# EasyEDA Pro project ProDoc_电源控制板.epro

# Schematic Schematic3
Board Name: USB扩展板V2.3; Create Date: 2025-10-12; Page Name: P1; Project Name: FAICAL TRACKER VR模块; Schematic Name: Schematic6_2; Update Date: 2026-01-19; BladeWidth: 10; Company: 嘉立创EDA; Page Size: A4; RegionStart: 1; ShowBorder: 1; TitleBlock: 1; TitleBlockPosition: 3; Version: V1.0; XRegionCount: 6; YRegionCount: 4
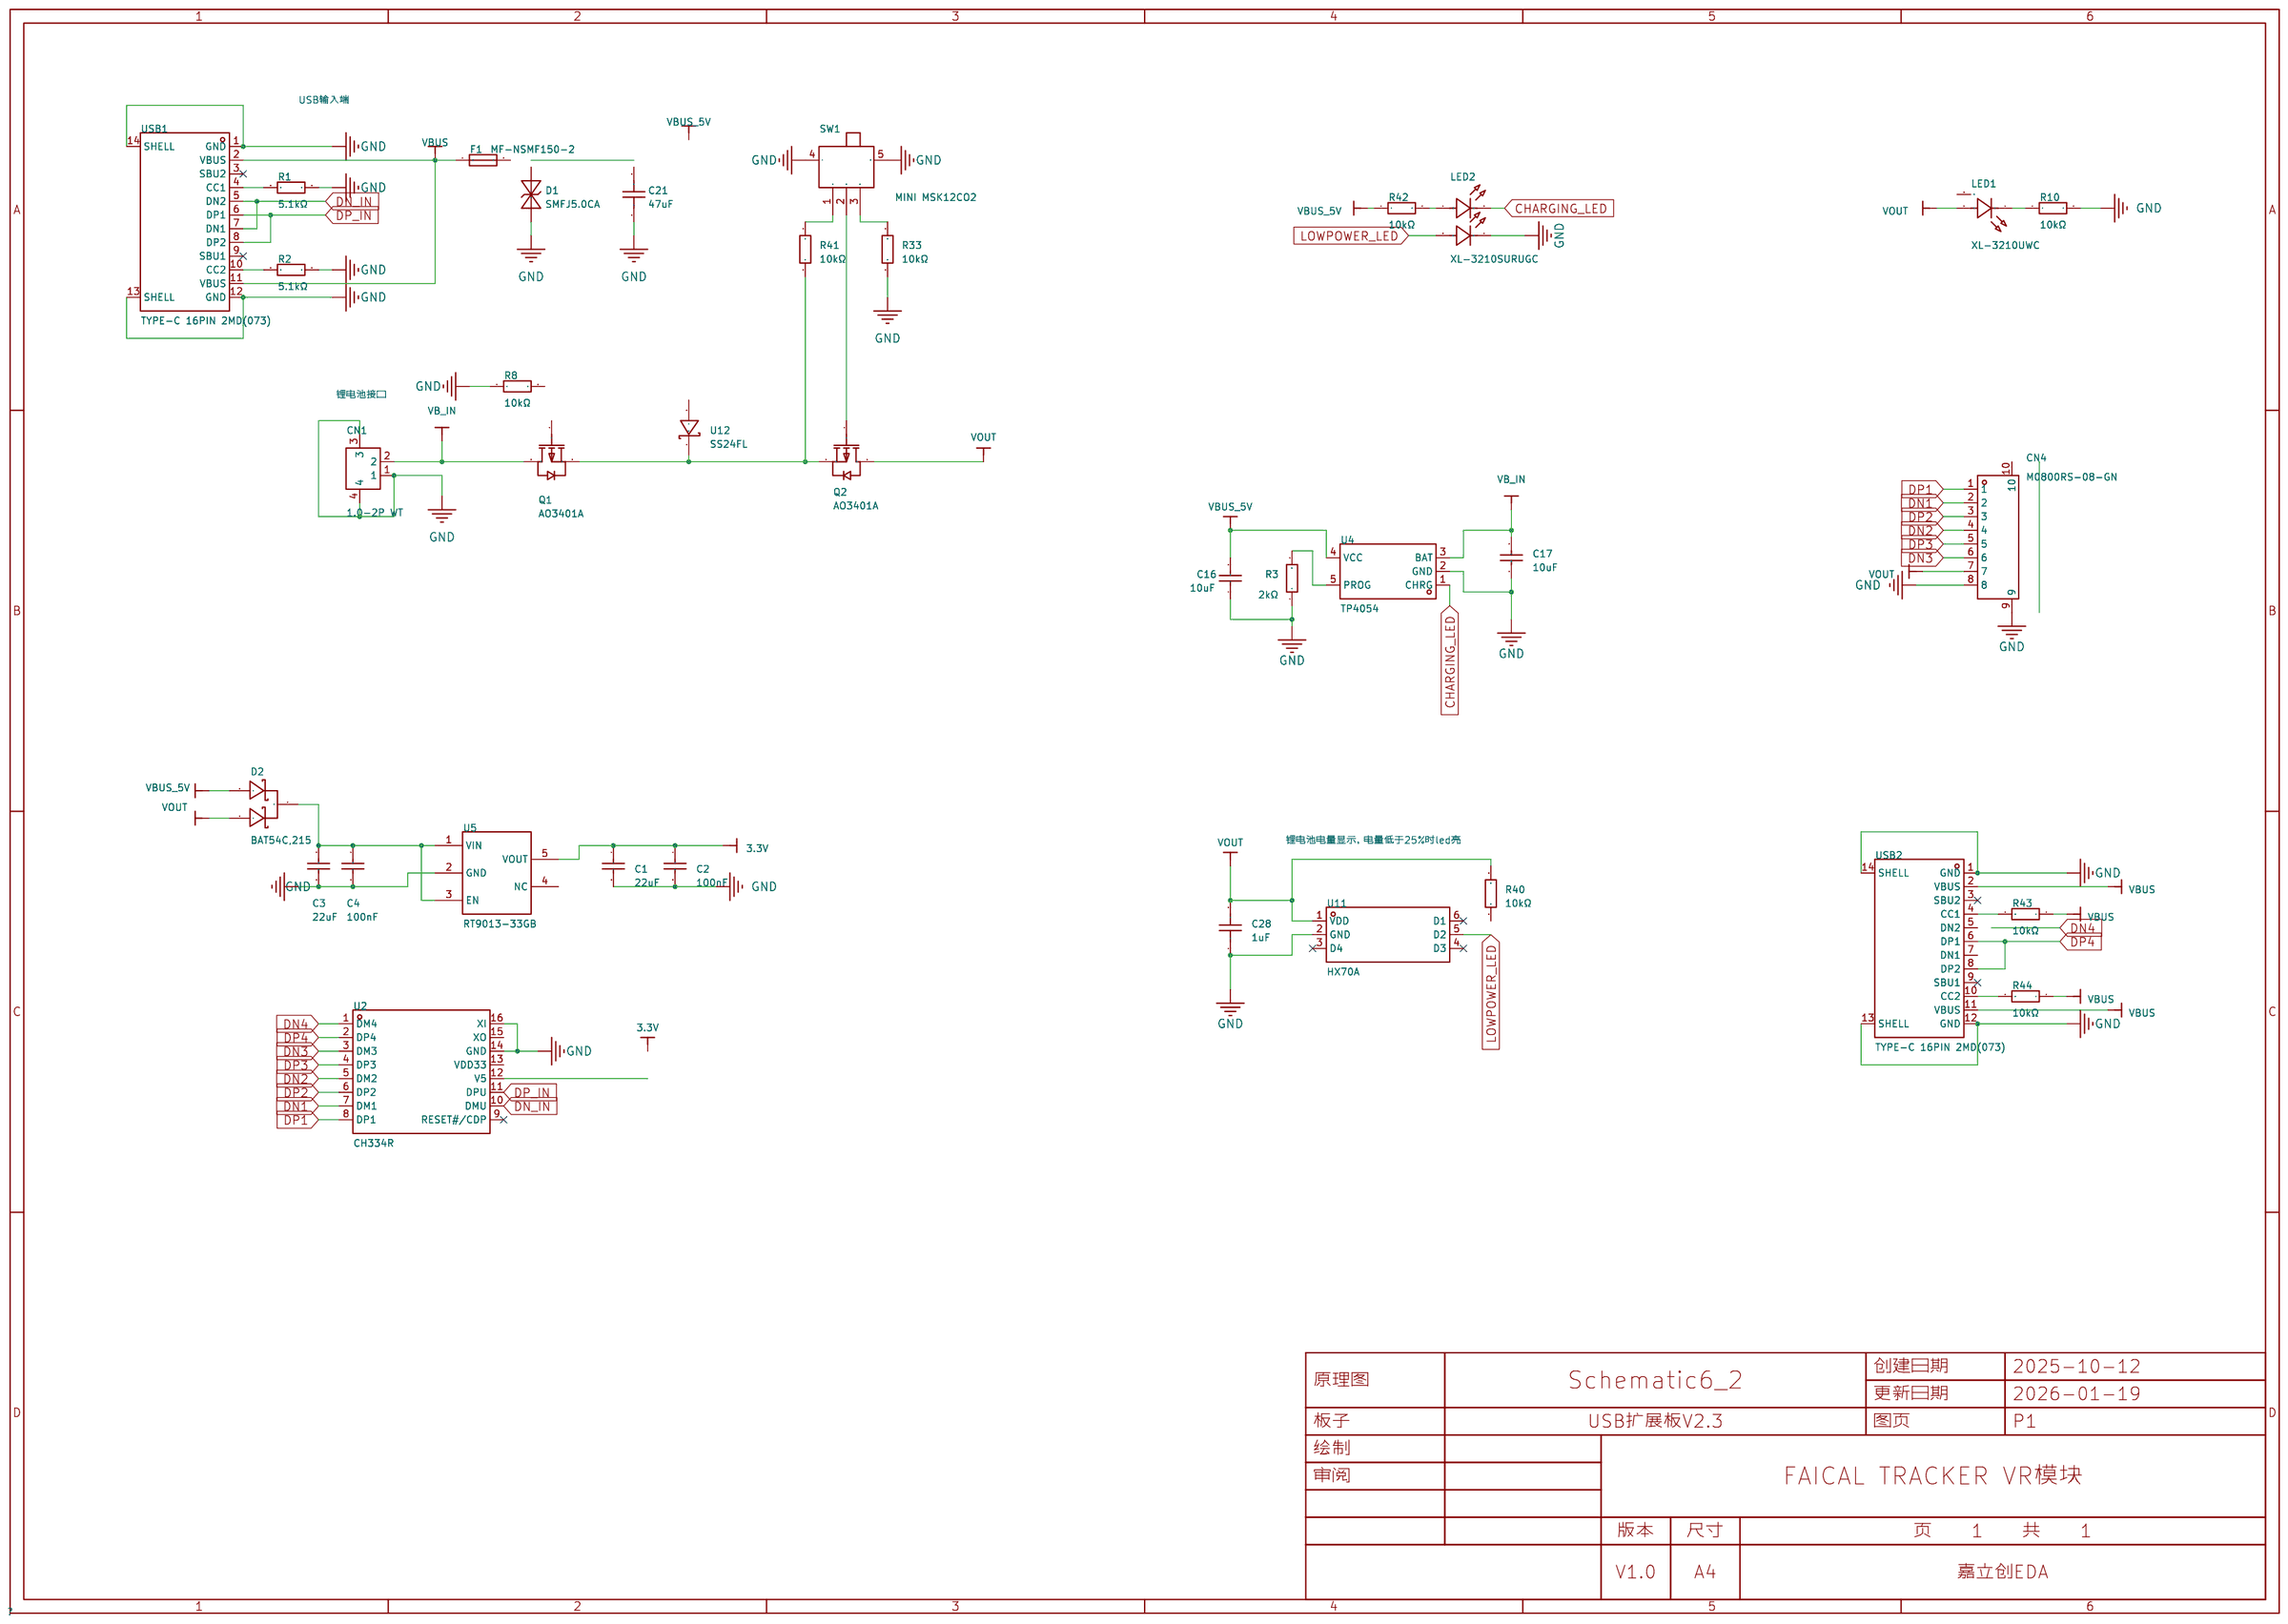
[diagram p0: schematic sheet]

## Parts
C1  22uF  [0603]
C2  100nF  [0402]
C3  22uF  [0603]
C4  100nF  [0402]
C16  10uF  [0603]
C17  10uF  [0603]
C21  47uF  [C1206]
C28  1uF  [0402]
CN1  1.0-2P WT  [CONN-SMD_2P-P1.00_SHOU-HAN_1.0-2P-WT]
CN4  M0800RS-08-GN  [CONN-SMD_M0800RS-08-GN]
D1  SMFJ5.0CA  [SOD-123_L2.7-W1.8-LS3.7-BI]
D2  BAT54C,215  [SOT-23_L2.9-W1.3-P1.90-LS2.4-BR]
F1  MF-NSMF150-2  [F1206]
LED1  XL-3210UWC  [LED-SMD_3P-L3.2-W1.5-RD_ORANGE]
LED2  XL-3210SURUGC  [LED-SMD_4P-L3.2-W1.5_HTG-3210SURUBGC]
Q1  AO3401A  [SOT-23_L2.9-W1.3-P1.90-LS2.4-BR]
Q2  AO3401A  [SOT-23_L2.9-W1.3-P1.90-LS2.4-BR]
R1  5.1kΩ  [0402]
R2  5.1kΩ  [0402]
R3  2kΩ  [0402]
R8  10kΩ  [0402]
R10  10kΩ  [0402]
R33  10kΩ  [0402]
R40  10kΩ  [0402]
R41  10kΩ  [0402]
R42  10kΩ  [0402]
R43  10kΩ  [0402]
R44  10kΩ  [0402]
SW1  MINI MSK12CO2  [SW-SMD_MSK12CO2]
U2  CH334R  [QSOP-16_L4.9-W3.9-P0.64-LS6.0-BL]
U4  TP4054  [SOT-23-5_L3.0-W1.6-P0.95-LS2.8-BL]
U5  RT9013-33GB  [SOT-23-5_L3.0-W1.6-P0.95-LS2.8-BL]
U11  HX70A  [SOT-23-6_L2.9-W1.6-P0.95-LS2.8-BL]
U12  SS24FL  [SOD-123FL_L2.8-W1.8-LS3.6-RD]
USB1  TYPE-C 16PIN 2MD(073)  [USB-C-SMD_TYPE-C-6PIN-2MD-073]
USB2  TYPE-C 16PIN 2MD(073)  [USB-C-SMD_TYPE-C-6PIN-2MD-073]

## Library data of the parts
C1 C3 = CL10A226MQ8NRNC: 容值:22uF;精度:±20%;额定电压:6.3V;温度系数:X5R;; LCSC Part Name: 22uF ±20% 6.3V; Supplier Part: C59461; Manufacturer: SAMSUNG(三星); JLCPCB Part Class: Basic Part; Datasheet: https://item.szlcsc.com/datasheet/CL10A226MQ8NRNC/60514.html; Supplier: LCSC; Tolerance: ±20%; Voltage Rated: 6.3V; Temperature Coefficient: X5R; Voltage Rating: 6.3V
C2 C4 = 0402B104K500NT: 容值:100nF;精度:±10%;额定电压:50V;温度系数:X7R;; LCSC Part Name: 100nF ±10% 50V; Supplier Part: C110251; Manufacturer: FH(风华); JLCPCB Part Class: Extended Part; Datasheet: https://atta.szlcsc.com/upload/public/pdf/source/20200305/C486355_26A10D38EF8C2A5C37091D0039909270.pdf; Supplier: LCSC; Tolerance: ±10%; Voltage Rating: 50V; Temperature Coefficient: X7R
C16 C17 = CL10A106KP8NNNC: 容值:10uF;精度:±10%;额定电压:10V;温度系数:X5R;; LCSC Part Name: 10uF ±10% 10V; Supplier Part: C19702; Manufacturer: SAMSUNG(三星); JLCPCB Part Class: 基础库; Datasheet: https://item.szlcsc.com/datasheet/CL10A106KP8NNNC/20411.html; Supplier: LCSC; Tolerance: ±10%; Voltage Rated: 10V; Temperature Coefficient: X5R; Voltage Rating: 10V
C21 = HGC1206R5476M250NSPJ: 容值:47uF;精度:±20%;额定电压:25V;温度系数:X5R;; LCSC Part Name: 47uF ±20% 25V; Supplier Part: C22367835; Manufacturer: Chinocera(华瓷); Supplier Footprint: 1206; JLCPCB Part Class: 扩展库; Datasheet: https://atta.szlcsc.com/upload/public/pdf/source/20240326/E6CB0DC43BB858B74F4352229FABFDCA.pdf; Supplier: LCSC; Tolerance: ±20%; Voltage Rating: 25V; Temperature Coefficient: X5R
C28 = CL05A105KA5NQNC: 容值:1uF;精度:±10%;额定电压:25V;材质(温度系数):X5R;; LCSC Part Name: 1uF ±10% 25V; Supplier Part: C52923; Manufacturer: SAMSUNG(三星); JLCPCB Part Class: 基础库; Datasheet: https://atta.szlcsc.com/upload/public/pdf/source/20160218/1457707763339.pdf; Supplier: LCSC; Tolerance: ±10%; Voltage Rated: 25V; Temperature Coefficient: X5R
CN1 = 1.0-2P WT: 插针结构:1x2P;间距:1mm;安装方式:卧贴;参考系列:SH;总PIN数:2P;排数:1;每排PIN数:2;行距:-;额定电流:1A;触头材质:磷青铜;触头镀层:锡;工作温度:-25℃~+85℃;; LCSC Part Name: 1.0-2P卧贴 编带; Supplier Part: C2906268; Manufacturer: SHOU HAN(首韩); Supplier Footprint: SMD,P=1mm,卧贴; JLCPCB Part Class: Extended Part; Datasheet: https://item.szlcsc.com/datasheet/1.0-2P%2520WT/3178978.html; Supplier: LCSC; Pins Structure: 1x2P; Pitch: 1mm; Mounting Type: 卧贴; Reference Series: SH; Number of Pins: 2P; Number of Rows: 1; Number of PINs Per Row: 2; Current Rating: 1A; Contact Material: 磷青铜; Contact Plating: 锡; Operating Temperature: -25℃~+85℃; Voltage Rating: 125V; Plastic Material: LCP; Flame Retardant Rating: UL94V-0; Color: 米色
CN4 = M0800RS-08-GN: 插针结构:1x8P;间距:0.8mm;安装方式:卧贴;参考系列:-;总PIN数:8P;排数:1;每排PIN数:8;行距:-;额定电流:-;工作温度范围:-;; LCSC Part Name: 1x8P 间距:0.8mm 卧贴; Supplier Part: C509170; Manufacturer: XFCN(兴飞); Supplier Footprint: SMD,P=0.8mm,卧贴; JLCPCB Part Class: Extended Part; Datasheet: https://atta.szlcsc.com/upload/public/pdf/source/20200407/C509164_BF52F945AC88792F216409D296077FAE.pdf; Supplier: LCSC; Pins Structure: 1x8P; Pitch: 0.8mm; Mounting Style: 卧贴; Number of Pins: 8P; Number of Rows: 1; Number of PINs Per Row: 8
D1 = SMFJ5.0CA: 反向截止电压(Vrwm):5V;最大钳位电压:9.2V;峰值脉冲电流(Ipp):21.7A;击穿电压:6.4V;; Supplier Part: C2905638; Manufacturer: TECH PUBLIC(台舟); Supplier Footprint: SOD-123FL; JLCPCB Part Class: Extended Part; Datasheet: https://atta.szlcsc.com/upload/public/pdf/source/20211026/3B8FA2C5551EFBFD99ABC853C5618374.pdf; Supplier: LCSC; Reverse Stand-Off Voltage (Vrwm): 5V; Maximum Clamping Voltage: 9.2V; Peak Pulse Current (Ipp): 21.7A; Breakdown Voltage: 6.4V; Reverse Leakage Current (Ir): 400uA; Type: TVS
D2 = BAT54C,215: 二极管配置:1对共阴极;正向压降(Vf):800mV@100mA;直流反向耐压(Vr):30V;整流电流:200mA;; LCSC Part Name: 电压:30V 电流:200mA; Supplier Part: C37704; Manufacturer: Nexperia(安世); Supplier Footprint: SOT-23; JLCPCB Part Class: Extended Part; Datasheet: https://item.szlcsc.com/datasheet/BAT54C%252C215/38684.html; Supplier: LCSC; Diode Configuration: 1对共阴极; Voltage - Forward(Vf@If): 800mV@100mA; Voltage - DC Reverse(Vr): 30V; Current - Rectified: 200mA; Reverse Leakage Current (Ir): 2uA@25V; Non-Repetitive Peak Forward Surge Current: 600mA
F1 = MF-NSMF150-2: 最大电压:6V;最大电流:100A;保持电流:1.5A;跳闸电流:3A;; LCSC Part Name: 6V 1.5A 1206自恢复; Supplier Part: C89655; Manufacturer: BOURNS; Supplier Footprint: 1206; JLCPCB Part Class: Extended Part; Datasheet: https://atta.szlcsc.com/upload/public/pdf/source/20161125/1480068355439.pdf; Supplier: LCSC; Operating Voltage (Max): 6V; Current Rating (Max): 100A; Hold Current: 1.5A; Trip Current: 3A; Resistance - Initial (Ri) (Min): 30mΩ; Resistance - Post Trip (R1) (Max): 130mΩ; Maximum Time to Trip: 300ms; Operating Temperature: -40℃~+85℃
LED1 = XL-3210UWC: 灯头类型:-;发光颜色:白色;正向压降(Vf):3.4V;功率:70mW;正向电流:20mA;波长:-;二极管配置:-;透镜颜色:黄色透镜;色温:8000K~12000K;发光强度:1100mcd;发光角度:120°;载带方式:侧贴;工作温度:-40℃~+85℃;; LCSC Part Name: 贴片式发光二极管; Supplier Part: C965880; Manufacturer: XINGLIGHT(成兴光); Supplier Footprint: SMD-3P,3.2x1.5mm; JLCPCB Part Class: 扩展库; Datasheet: https://item.szlcsc.com/datasheet/XL-3210UWC/1051489.html; Supplier: LCSC; Illumination Color: 白色; Voltage - Forward(Vf): 3.4V; Power(Watts): 70mW; Forward Current: 20mA; Lens Color: 黄色透镜; Color Temperature: 8000K~12000K; Luminous Intensity: 1100mcd; Viewing Angle: 120°; Mounting Style: 侧贴; Operating Temperature: -40℃~+85℃
LED2 = XL-3210SURUGC: 灯头类型:-;发光颜色:红色,翠绿色;正向压降(Vf):2.4V；3.4V;功率:50mW；70mW;正向电流:20mA;波长:620nm~630nm；520nm~530nm;二极管配置:-;透镜颜色:无色透明透镜;色温:-;发光强度:180mcd；750mcd;发光角度:120°;载带方式:侧贴;工作温度:-40℃~+85℃;; LCSC Part Name: 红翠绿双色贴片式发光二极管; Supplier Part: C965883; Manufacturer: XINGLIGHT(成兴光); Supplier Footprint: SMD-4P,3.2x1.5mm; JLCPCB Part Class: 扩展库; Datasheet: https://item.szlcsc.com/datasheet/XL-3210SURUGC/1051492.html; Supplier: LCSC; Illumination Color: 红色,翠绿色; Voltage - Forward(Vf): 2.4V；3.4V; Power(Watts): 50mW；70mW; Forward Current: 20mA; Wavelength - Dominant: 620nm~630nm；520nm~530nm; Peak Wavelength: 625nm；525nm; Lens Color: 无色透明透镜; Luminous Intensity: 180mcd；750mcd; Viewing Angle: 120°; Mounting Style: 侧贴; Operating Temperature: -40℃~+85℃
Q1 Q2 = AO3401A_C15127: 数量:1个P沟道;漏源电压(Vdss):30V;连续漏极电流(Id):4A;导通电阻(RDS(on)):47mΩ@10V；85mΩ@2.5V；60mΩ@4.5V;耗散功率(Pd):-;阈值电压(Vgs(th)):900mV@250uA;; LCSC Part Name: 1个P沟道 耐压:30V 电流:4A; Supplier Part: C15127; Manufacturer: AOS; Supplier Footprint: SOT-23; JLCPCB Part Class: Basic Part; Datasheet: https://item.szlcsc.com/datasheet/AO3401A/15801.html; Supplier: LCSC; Number: 1个P沟道; Drain to Source Voltage: 30V; Current - Continuous Drain(Id): 4A; RDS(on): 47mΩ@10V；85mΩ@2.5V；60mΩ@4.5V; Gate Threshold Voltage (Vgs(th)): 900mV@250uA; Gate Charge(Qg): 14nC@10V; Input Capacitance(Ciss): 645pF; Reverse Transfer Capacitance (Crss@Vds): 55pF; Output Capacitance(Coss): 80pF
R1 R2 = 0402WGF5101TCE: 电阻类型:厚膜电阻;阻值:5.1kΩ;精度:±1%;功率:62.5mW;工作电压:50V;温度系数:±100ppm/℃;; LCSC Part Name: 5.1kΩ ±1% 62.5mW 厚膜电阻; Supplier Part: C25905; Manufacturer: UNI-ROYAL(厚声); JLCPCB Part Class: Basic Part; Datasheet: https://item.szlcsc.com/datasheet/0402WGF5101TCE/26648.html; Supplier: LCSC; Type: 厚膜电阻; Tolerance: ±1%; Power(Watts): 62.5mW; Overload Voltage (Max): 50V; Temperature Coefficient: ±100ppm/℃; Operating Temperature Range: -55℃~+155℃; Voltage-Supply(Max): 50V; Operating Temperature: -55℃~+155℃
R3 = 0402WGF2001TCE: 电阻类型:厚膜电阻;阻值:2kΩ;精度:±1%;功率:62.5mW;最大工作电压:50V;温度系数:±100ppm/℃;; LCSC Part Name: 2kΩ ±1% 62.5mW 厚膜电阻; Supplier Part: C4109; Manufacturer: UNI-ROYAL(厚声); JLCPCB Part Class: 基础库; Datasheet: https://atta.szlcsc.com/upload/public/pdf/source/20200306/C422600_1E6D84923E4A46A82E41ADD87F860B5C.pdf; Supplier: LCSC; Type: 厚膜电阻; Tolerance: ±1%; Power(Watts): 62.5mW; Overload Voltage (Max): 50V; Temperature Coefficient: ±100ppm/℃; Operating Temperature Range: -55℃~+155℃
R8 R33 R41 = 0402WGF1002TCE: 电阻类型:厚膜电阻;阻值:10kΩ;精度:±1%;功率:62.5mW;最大工作电压:50V;温度系数:±100ppm/℃;; LCSC Part Name: 10kΩ ±1% 62.5mW 厚膜电阻; Supplier Part: C25744; Manufacturer: UNI-ROYAL(厚声); JLCPCB Part Class: Basic Part; Datasheet: https://atta.szlcsc.com/upload/public/pdf/source/20200306/C422600_1E6D84923E4A46A82E41ADD87F860B5C.pdf; Supplier: LCSC; Type: 厚膜电阻; Tolerance: ±1%; Power(Watts): 62.5mW; Overload Voltage (Max): 50V; Temperature Coefficient: ±100ppm/℃; Operating Temperature Range: -55℃~+155℃
R10 R40 R42-R44 = 0402WGF1002TCE: 电阻类型:厚膜电阻;阻值:10kΩ;精度:±1%;功率:62.5mW;工作电压:50V;温度系数:±100ppm/℃;; LCSC Part Name: 10kΩ ±1% 62.5mW 厚膜电阻; Supplier Part: C25744; Manufacturer: UNI-ROYAL(厚声); JLCPCB Part Class: Basic Part; Datasheet: https://item.szlcsc.com/datasheet/0402WGF1002TCE/26487.html; Supplier: LCSC; Type: 厚膜电阻; Tolerance: ±1%; Power(Watts): 62.5mW; Overload Voltage (Max): 50V; Temperature Coefficient: ±100ppm/℃; Operating Temperature Range: -55℃~+155℃; Voltage-Supply(Max): 50V; Operating Temperature: -55℃~+155℃
SW1 = MINI MSK12CO2: 电路结构:单刀双掷;安装方式:卧贴;开关颜色:白色;额定电流:50mA;额定电压:12V;工作寿命:1万次;; LCSC Part Name: 迷你七脚两档侧拨拨动 mini七7脚 微型拨动; Supplier Part: C2681570; Manufacturer: SHOU HAN(首韩); Supplier Footprint: SMD,5x2.8mm; JLCPCB Part Class: 扩展库; Datasheet: https://item.szlcsc.com/datasheet/MINI%2520MSK12CO2/2774913.html; Supplier: LCSC; Circuit: 单刀双掷; Actuator Style: 矩形柱状; Termination Style: SMD接片; Length: 5mm; Width: 2.75mm; Switch Height: 1.4mm; Mounting Type: 卧贴; Actuator Color: 白色; Current Rating: 50mA; Voltage Rating: 12V; Life: 1万次; Operating Temperature: -25℃~+70℃
U2 = CH334R: CH334和CH335是符合USB2.0协议规范的4端口USBHUB控制器芯片，上行端口支持USB2.0高速和全速，下行端口支持USB2.0高速480Mbps、全速12Mbps和低速1.5Mbps。; Supplier Part: C4154405; Manufacturer: WCH(南京沁恒); Supplier Footprint: QSOP-16-150mil; JLCPCB Part Class: 扩展库; Datasheet: https://atta.szlcsc.com/upload/public/pdf/source/20240313/F70B229B132CE2CA6E618A7ACAF406E8.pdf; Supplier: LCSC; type: 集线器; Protocol: USB 2.0; Data Rate: 480Mbps; Supply Voltage: 5V；3.3V; Operating Temperature: -40℃~+85℃
U4 = TP4054_C668215: 工作电压:4.2V~6.5V;最大充电电流:-;电池类型:锂离子;电池节数:1;; Supplier Part: C668215; Manufacturer: UMW(友台半导体); Supplier Footprint: SOT-23-5L; JLCPCB Part Class: 扩展库; Datasheet: https://item.szlcsc.com/datasheet/TP4054/698063.html; Supplier: LCSC; The Chip Type: 充电芯片; Voltage - Supply: 4.2V~6.5V; Charging Saturation Voltage: 4.2V; Type of Battery: 锂离子; Number of Cells: 1; Operating Temperature: -40℃~+85℃; Supply Current (Iq): 25uA
U5 = RT9013-33GB: 输出类型:固定;工作电压:5.5V;输出电压:3.3V;输出电流:500mA;电源纹波抑制比(PSRR):50dB@(10kHz);输出极性:正极;; LCSC Part Name: 输入5.5V 输出3.3V 500mA; Supplier Part: C47773; Manufacturer: RICHTEK(立锜); Supplier Footprint: SOT-23-5; JLCPCB Part Class: 扩展库; Datasheet: https://item.szlcsc.com/datasheet/RT9013-33GB/48778.html; Supplier: LCSC; Output Type: 固定; Voltage - Supply: 5.5V; Output Voltage: 3.3V; Output Current: 500mA; Power Supply Rejection Ratio (PSRR): 50dB@(10kHz); Voltage Dropout: 400mV@(500mA); standby current: 25uA; Noise: 30uVrms; Features: 带使能；过热保护；过流保护; Operating Temperature: -40℃~+125℃@(Tj); Output Configuration: 正极; Number of Outputs: 1
U11 = HX70A: Supplier Part: C2846626; Supplier Footprint: SOT-23-6; JLCPCB Part Class: Extended Part; Supplier: LCSC
U12 = SS24FL_C894433: 正向压降(Vf):550mV@2A;直流反向耐压(Vr):40V;整流电流:2A;; LCSC Part Name: 电压:40V 电流:2A; Supplier Part: C894433; Manufacturer: onsemi(安森美); Supplier Footprint: SOD-123F; JLCPCB Part Class: 扩展库; Datasheet: https://item.szlcsc.com/datasheet/SS24FL/959862.html; Supplier: LCSC; Voltage - Forward(Vf@If): 550mV@2A; Voltage - DC Reverse(Vr): 40V; Current - Rectified: 2A; Reverse Leakage Current (Ir): 100uA@40V; Operating Junction Temperature Range: -55℃~+125℃; Non-Repetitive Peak Forward Surge Current: 50A
USB1 USB2 = TYPE-C 16PIN 2MD(073): 连接器类型:Type-C;协议标准:USB 3.1;公母:母;安装方式:卧贴;触点数量:16P;端口数量:1;额定电流 - 电源:3A;工作温度:-25℃~+85℃;; LCSC Part Name: Type-C 母 卧贴; Supplier Part: C2765186; Manufacturer: SHOU HAN(首韩); Supplier Footprint: SMD; JLCPCB Part Class: 扩展库; Datasheet: https://item.szlcsc.com/datasheet/TYPE-C%252016PIN%25202MD(073)/2901843.html; Supplier: LCSC; Connector Type: Type-C; Protocol Standard: USB 3.1; Gender: 母; Mounting Type: 卧贴; Number of Contacts: 16P; Number of Ports: 1; Current Rating-Power: 3A; Voltage Rating: 5V; Connect-Disconnect Life: 5千次; Detection color: 黑色; Operating Temperature: -25℃~+85℃

## Nets
3.3V: C1.1 C2.1 U2.12(V5) U2.13(VDD33) U5.5(VOUT)
GND: C1.2 C2.2 C3.1 C4.1 C16.1 C17.1 C21.1 C28.1 CN1.1 CN1.3 CN1.4 CN4.8 CN4.9 CN4.10 D1.1 LED2.4(R-) R1.1 R2.1 R3.1 R8.1 R10.2 R33.1 SW1.4 SW1.5 U2.14(GND) U2.16(XI) U4.2(GND) U5.2(GND) U11.2(GND) USB1.1(GND) USB1.12(GND) USB1.13(SHELL) USB1.14(SHELL) USB2.1(GND) USB2.12(GND) USB2.13(SHELL) USB2.14(SHELL)
VBUS: F1.1 R43.1 R44.1 USB1.2(VBUS) USB1.11(VBUS) USB2.2(VBUS) USB2.11(VBUS)
VBUS_5V: C16.2 C21.2 D1.2 D2.1(A) F1.2 Q1.1(G) R8.2 R42.1 U4.4(VCC) U12.2(A)
CHARGING_LED: LED2.2(G-) U4.1(CHRG)
DN1: CN4.2 U2.7(DM1)
DN2: CN4.4 U2.5(DM2)
DN3: CN4.6 U2.3(DM3)
DN4: U2.1(DM4) USB2.5(DN2) USB2.7(DN1)
DN_IN: U2.10(DMU) USB1.5(DN2) USB1.7(DN1)
DP1: CN4.1 U2.8(DP1)
DP2: CN4.3 U2.6(DP2)
DP3: CN4.5 U2.4(DP3)
DP4: U2.2(DP4) USB2.6(DP1) USB2.8(DP2)
DP_IN: U2.11(DPU) USB1.6(DP1) USB1.8(DP2)
LOWPOWER_LED: LED2.3(R+) R40.1 U11.5(D2)
VB_IN: C17.2 CN1.2 Q1.3(D) U4.3(BAT)
VOUT: C28.2 CN4.7 D2.2(A) LED1.2(A) Q2.3(D) R40.2 U11.1(VDD)
$1N510: R2.2 USB1.10(CC2)
$1N514: R1.2 USB1.4(CC1)
$1N3050: LED1.1(K) R10.1
$1N38183: R33.2 SW1.3
$1N38879: R3.2 U4.5(PROG)
$1N38917: Q2.1(G) SW1.2
$1N38949: Q1.2(S) Q2.2(S) R41.2 U12.1(C)
$1N38952: R41.1 SW1.1
$1N41051: R44.2 USB2.10(CC2)
$1N41052: R43.2 USB2.4(CC1)
$1N42853: LED2.1(G+) R42.2
$1N44886: C3.2 C4.2 D2.3(K) U5.1(VIN) U5.3(EN)

Not connected (* = marked no-connect by the designer): LED1 3; U2 9(RESET#/CDP)* 15(XO); U5 4(NC); U11 3(D4)* 4(D3)* 6(D1)*; USB1 3(SBU2)* 9(SBU1)*; USB2 3(SBU2)* 9(SBU1)*

## Notes on the sheet
- USB输入端
- 锂电池接口
- 锂电池电量显示，电量低于25%时led亮

# Board PCB3
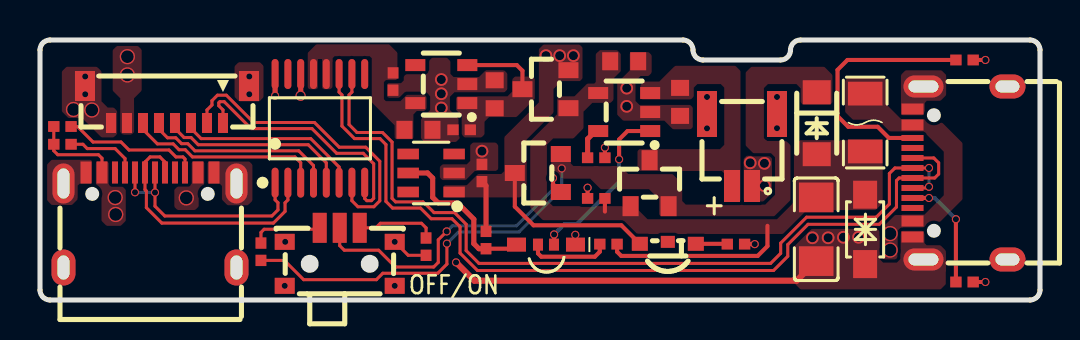
[diagram p1: board, top side]
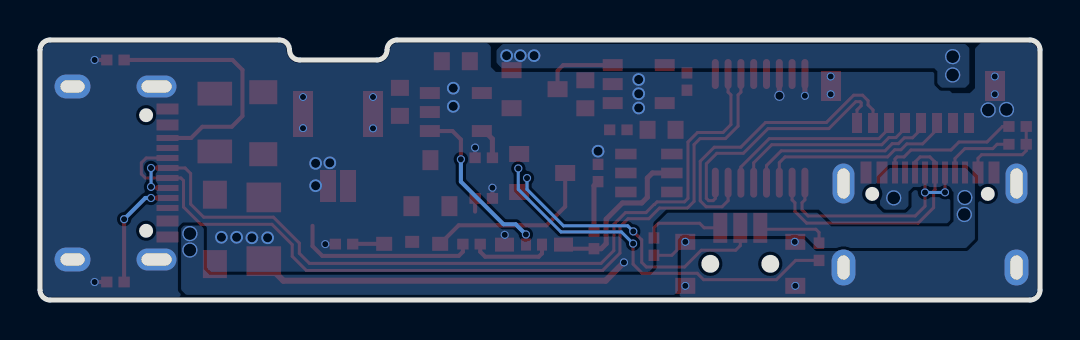
[diagram p2: board, bottom side, seen from below]

Outline 50 x 13 mm; copper layers: Top Layer, Bottom Layer. Coordinates in mm from the lower left corner of the outline.
Outline path: 0,12.5 arc(0.15,12.85) 0.5,13 32.15,13 arc(32.5,12.85) 32.65,12.5 arc(32.8,12.15) 33.15,12 37.03,12 arc(37.38,12.15) 37.53,12.5 arc(37.67,12.85) 38.03,13 49.5,13 arc(49.85,12.85) 50,12.5 50,0.5 arc(49.85,0.15) 49.5,0 0.5,0 arc(0.15,0.15) 0,0.5 0,12.5
Stack: Top Layer 0.035mm / SUBSTRATE1 0.91mm FR4 er 4.5 / Bottom Layer 0.035mm

## Design rules (mm)
net DP2: DP3
net DP3: DP2
net DP4: DP1
net DP1: DP5
net DP_IN: DP4
net DN4: DP1
net DN3: DP2
net DN2: DP3
net DN1: DP5
net DN_IN: DP4
spacing copperThickness1oz (default): track to track 0.152, other pairs 0 to 0.3
spacing copperThickness2oz: track to track 0.203, other pairs 0.152 to 0.3
spacing Copper_copperRegion: track to track 0.152, other pairs 0 to 0.3
spacing Copper_copperRegion1: track to track 0.152, other pairs 0 to 0.3
spacing Plane_innerPlane: track to track 0.152, other pairs 0 to 0.3
track width copperThickness1oz (default): min 0.127, default 0.254, max 2.54
track width copperThickness2oz: min 0.203, default 0.254, max 2.54
differential pair USB-90Ω (default): width min 0.152, default 0.152, max 0.203; gap min 0.152, default 0.152
differential pair differentialPair: width min 0.127, default 0.254, max 2.54; gap min 0.152, default 0.152
pour e52 uses Copper_copperRegion, copperRegion1_Copper_copperRegion
net GND uses copperRegion_copperThickness1oz
pour e136 uses Copper_copperRegion, copperRegion1_Copper_copperRegion
pour e156 uses Copper_copperRegion, copperRegion1_Copper_copperRegion
pour e197 uses Copper_copperRegion, copperRegion1_Copper_copperRegion
pour e212 uses Copper_copperRegion, copperRegion1_Copper_copperRegion
pour e334 uses Copper_copperRegion, copperRegion1_Copper_copperRegion
net VBUS_5V uses copperRegion1_copperThickness1oz
net VB_IN uses copperRegion1_copperThickness1oz
net $1N38949 uses copperRegion1_copperThickness1oz
net 3.3V uses copperRegion1_copperThickness1oz
net VOUT uses copperRegion1_copperThickness1oz
net $1N44886 uses copperRegion1_copperThickness1oz
pour e19 uses Copper_copperRegion1, copperRegion_Copper_copperRegion1
pour e407 uses Copper_copperRegion1, copperRegion1_Copper_copperRegion1
pour e409 uses Copper_copperRegion1, copperRegion1_Copper_copperRegion1
pour e481 uses Copper_copperRegion, copperRegion1_Copper_copperRegion
pour e483 uses Copper_copperRegion, copperRegion1_Copper_copperRegion
pour e485 uses Copper_copperRegion, copperRegion1_Copper_copperRegion
pour e487 uses Copper_copperRegion, copperRegion1_Copper_copperRegion

## Placement (name value [footprint] x y rotation side)
C1  22uF  [0603]  18.92 8.51 0 top
C2  100nF  [0402]  17.65 10.92 270 top
C3  22uF  [0603]  22.73 10.29 270 top
C4  100nF  [0402]  21.08 8.51 0 top
C16  10uF  [0603]  29.21 11.94 180 top
C17  10uF  [0603]  32 9.91 90 top
C21  47uF  [C1206]  38.81 3.54 90 top
C28  1uF  [0402]  22.1 6.35 270 top
CN1  1.0-2P WT  [CONN-SMD_2P-P1.00_SHOU-HAN_1.0-2P-WT]  35.1 7.5 180 top
CN4  M0800RS-08-GN  [CONN-SMD_M0800RS-08-GN]  6.35 9.8 180 top
D1  SMFJ5.0CA  [SOD-123_L2.7-W1.8-LS3.7-BI]  41.26 3.53 90 top
D2  BAT54C,215  [SOT-23_L2.9-W1.3-P1.90-LS2.4-BR]  25.27 10.54 0 top
F1  MF-NSMF150-2  [F1206]  41.26 8.87 270 top
LED1  XL-3210UWC  [LED-SMD_3P-L3.2-W1.5-RD_ORANGE]  31.39 2.94 180 top
LED2  XL-3210SURUGC  [LED-SMD_4P-L3.2-W1.5_HTG-3210SURUBGC]  25.3 2.64 180 top
Q1  AO3401A  [SOT-23_L2.9-W1.3-P1.90-LS2.4-BR]  30.48 5.84 270 top
Q2  AO3401A  [SOT-23_L2.9-W1.3-P1.90-LS2.4-BR]  24.89 6.35 0 top
R1  5.1kΩ  [0402]  46.23 0.9 180 top
R2  5.1kΩ  [0402]  46.23 12 180 top
R3  2kΩ  [0402]  27.81 7.11 180 top
R8  10kΩ  [0402]  27.81 5.08 0 top
R10  10kΩ  [0402]  34.8 2.79 0 top
R33  10kΩ  [0402]  19.3 2.67 90 top
R40  10kΩ  [0402]  22.3 3 90 top
R41  10kΩ  [0402]  11.05 2.41 270 top
R42  10kΩ  [0402]  28.42 2.79 180 top
R43  10kΩ  [0402]  1.12 7.79 0 top
R44  10kΩ  [0402]  1.12 8.68 0 top
SW1  MINI MSK12CO2  [SW-SMD_MSK12CO2]  14.99 2.16 0 top
U2  CH334R  [QSOP-16_L4.9-W3.9-P0.64-LS6.0-BL]  14 8.58 0 top
U4  TP4054  [SOT-23-5_L3.0-W1.6-P0.95-LS2.8-BL]  29.21 9.4 90 top
U5  RT9013-33GB  [SOT-23-5_L3.0-W1.6-P0.95-LS2.8-BL]  20.07 10.8 90 top
U11  HX70A  [SOT-23-6_L2.9-W1.6-P0.95-LS2.8-BL]  19.56 6.35 90 top
U12  SS24FL  [SOD-123FL_L2.8-W1.8-LS3.6-RD]  38.84 8.84 270 top
USB1  TYPE-C 16PIN 2MD(073)  [USB-C-SMD_TYPE-C-6PIN-2MD-073]  46 6.35 90 top
USB2  TYPE-C 16PIN 2MD(073)  [USB-C-SMD_TYPE-C-6PIN-2MD-073]  5.5 4 0 top

## Footprints (pads in the part's own frame, mm; a bottom-side part is the same pattern mirrored in y, then rotated)
0402
  rect 0.566x0.54 smd: 1(-0.433,0) 2(0.433,0)
0603
  rect 0.8x0.9 smd: 1(-0.7,0) 2(0.7,0)
C1206
  rect 1.485x1.728 smd: 1(-1.593,0) 2(1.593,0)
CONN-SMD_2P-P1.00_SHOU-HAN_1.0-2P-WT
  rect 0.8x1.6 smd: 1(-0.5,1.8) 2(0.5,1.8)
  rect 1x2.3 smd: 3(1.75,-1.8) 4(-1.75,-1.8)
CONN-SMD_M0800RS-08-GN
  rect 0.5x1 smd: 1(-2.8,0.95) 2(-2,0.95) 3(-1.2,0.95) 4(-0.4,0.95) 5(0.4,0.95) 6(1.2,0.95) 7(2,0.95) 8(2.8,0.95)
  rect 1x1.5 smd: 9(4.1,-0.9) 10(-4.1,-0.9)
F1206
  rect 1.19x1.728 smd: 1(-1.445,0) 2(1.445,0)
LED-SMD_3P-L3.2-W1.5-RD_ORANGE
  rect 0.8x0.7 smd: 1(-1.4,0.127) 2(1.4,0.127)
  rect 0.7x0.6 smd: 3(0,0.03)
LED-SMD_4P-L3.2-W1.5_HTG-3210SURUBGC
  rect 0.5x0.6 smd: 1(0.4,-0.133) 2(-0.4,-0.133)
  rect 0.95x0.7 smd: 3(1.475,-0.132) 4(-1.475,-0.132)
QSOP-16_L4.9-W3.9-P0.64-LS6.0-BL
  oval 0.35x1.5 smd: 1(-2.24,-2.716) 2(-1.6,-2.716) 3(-0.96,-2.716) 4(-0.32,-2.716) 5(0.32,-2.716) 6(0.96,-2.716) 7(1.6,-2.716) 8(2.24,-2.716) 9(2.24,2.716) 10(1.6,2.716) 11(0.96,2.716) 12(0.32,2.716) 13(-0.32,2.716) 14(-0.96,2.716) 15(-1.6,2.716) 16(-2.24,2.716)
SOD-123_L2.7-W1.8-LS3.7-BI
  rect 1.4x1.2 smd: 1(-1.735,0) 2(1.735,0)
SOD-123FL_L2.8-W1.8-LS3.6-RD
  rect 1.2x1.4 smd: 1(-1.55,0) 2(1.55,0)
SOT-23-5_L3.0-W1.6-P0.95-LS2.8-BL
  rect 0.6x1 smd: 1(-0.95,-1.3) 2(0,-1.3) 3(0.95,-1.3) 4(0.95,1.3) 5(-0.95,1.3)
SOT-23-6_L2.9-W1.6-P0.95-LS2.8-BL
  rect 0.532x1.072 smd: 1(-0.95,-1.149) 2(0,-1.149) 3(0.95,-1.149) 4(0.95,1.149) 5(0,1.149) 6(-0.95,1.149)
SOT-23_L2.9-W1.3-P1.90-LS2.4-BR
  rect 1x0.8 smd: 1(1.15,-0.95) 2(1.15,0.95) 3(-1.15,0)
SW-SMD_MSK12CO2
  rect 0.7x1.5 smd: 1(-1,1.45) 2(0,1.45) 3(1,1.45)
  rect 1x0.8 smd: 4(-2.75,0.75) 4(-2.75,-1.45) 5(2.75,0.75) 5(2.75,-1.45)
USB-C-SMD_TYPE-C-6PIN-2MD-073
  rect 0.55x1.1 smd: 1(-3.2,2.375) 2(-2.4,2.375) 11(2.4,2.375) 12(3.2,2.375)
  rect 0.3x1.1 smd: 3(-1.75,2.375) 4(-1.25,2.375) 5(-0.75,2.375) 6(-0.25,2.375) 7(0.25,2.375) 8(0.75,2.375) 9(1.25,2.375) 10(1.75,2.375)
  oval 1.1x2 hole 0.6x1.5: 13(-4.325,1.825) 14(4.325,1.825)
  oval 1.2x1.8 hole 0.6x1.2: 13(-4.325,-2.375) 14(4.325,-2.375)

## Nets
As in the schematic.

Pads without a net: LED1 3; U2 9 15; U5 4; U11 3 4 6; USB1 3 9; USB2 3 9

## Via types
v1: diameter 0.406, hole 0.305, Top Layer to Bottom Layer, 32 vias
v2: diameter 0.635, hole 0.457, Top Layer to Bottom Layer, 16 vias
v3: diameter 0.762, hole 0.635, Top Layer to Bottom Layer, 9 vias
v4: diameter 0.508, hole 0.406, Top Layer to Bottom Layer, 1 via

## Routing (per net, layer and track width the routed paths; a pad name or vN(x,y) marks a point on that pad's centre or on a via; arc(x,y) is an arc through that point)
GND: length 25.7
  Top Layer w0.152: R33.1 18.41,2.23 v1(17.74,2.91)
  Top Layer w0.203: R10.2 v1(35.74,2.79) ; R8.1 v1(27.38,5.61) ; v1(47.27,12) R2.1 ; SW1.4 v1(12.26,2.91) ; 46.74,0.9 v1(47.27,0.9) ; R3.1 v1(28.25,7.62)
  Top Layer w0.254: v4(13.03,10.21) 13.04,10.22 13.04,11.15 ; 11.76,11.15 v1(11.76,10.21) ; LED2.4 26.76,2.78 v1(26.76,3.26)
  Top Layer w0.305: C21.1 37.83,0.97 21.72,0.97 v1(20.8,1.88)
  vias: v1(2.26,11.18) v1(2.26,10.29) v1(10.47,11.18) v1(10.47,10.29) v1(12.24,0.71) v1(17.74,0.71) v1(33.35,10.15) v1(33.35,8.58) v1(36.85,10.15) v1(36.85,8.59) v2(20.07,11.02) v2(20.07,10.31) v2(20.07,9.6) v2(22.1,7.44) v2(29.34,10.59) v2(29.34,9.68) v2(35.51,6.86) v2(36.22,6.83) v2(36.22,5.72) v2(38.62,3.11) v2(39.41,3.11) v2(40.17,3.14) v2(40.93,3.14) v3(1.68,9.52) v3(2.59,9.5)
VBUS: length 4.5
  Top Layer w0.152: R44.1 R43.1 0.69,7.46 0.89,7.26 2.92,7.26 3.1,7.09 USB2.2
  vias: v3(3.76,5.12) v3(3.78,4.28) v3(7.32,5.11) v3(42.51,3.32) v3(42.51,2.5)
VBUS_5V: length 9.9
  Top Layer w0.203: R42.1 28.86,2.41 29.06,2.21 35.89,2.21 36.37,2.69 36.37,3.71 ; R8.2 28.25,4.42
CHARGING_LED: length 8.7
  Top Layer w0.203: 30.51,8.45 29.38,8.45 28.96,8.03 v1(28.96,7.04) ; LED2.2 25.7,2.77 v1(25.7,3.28)
  Bottom Layer w0.203: v1(28.96,7.04) 28.96,5.92 26.82,3.78 26.21,3.78 v1(25.7,3.28)
DN1: length 15.6
  Top Layer w0.152: U2.7 15.6,4.97 15.9,4.66 16.69,4.66 16.99,4.96 16.99,6.94 16.29,7.64 14.96,7.64 13.72,8.88 10.68,8.88 9.32,10.24 8.87,10.24 8.6,9.97 8.6,9.75 8.35,9.5 CN4.2
DN2: length 9.7
  Top Layer w0.152: CN4.4 6.75,8.58 7.21,8.12 7.55,8.12 7.91,7.76 13.41,7.76 14.32,6.86 14.32,5.72
DN3: length 10
  Top Layer w0.152: CN4.6 5.15,8.52 5.87,7.8 6.66,7.8 6.95,7.51 7.26,7.51 7.62,7.15 12.75,7.15 13.04,6.86 13.04,5.72
DN4: length 11.6
  Top Layer w0.152: 5.75,5.32 5.75,4.69 6.24,4.2 11.59,4.2 11.9,4.51 11.9,4.87 11.76,5.01 U2.1 ; 5.75,5.32 5.74,5.31 ; 5.75,5.32 v1(5.75,5.38) USB2.7 ; USB2.5 v1(4.75,5.39)
  Bottom Layer w0.152: v1(5.75,5.38) 4.76,5.38 v1(4.75,5.39)
DN_IN: length 41.8
  Top Layer w0.152: v1(44.45,5.66) 44.39,5.6 USB1.5 ; U2.10 15.6,10.4 15.45,10.25 15.45,8.77 15.85,8.38 17.12,8.38 17.6,7.9 17.6,5.08 17.78,4.91 19.15,4.91 19.28,4.78 19.3,4.78 19.7,4.37 20.73,4.37 21.31,3.79 21.31,2.47 21.95,1.83 36.53,1.83 37.03,2.33 37.03,2.84 38.33,4.14 41.81,4.14 42.47,4.8 42.47,6.33 42.75,6.6 USB1.7 v1(44.45,6.6)
  Bottom Layer w0.152: v1(44.45,6.6) v1(44.45,5.66)
DP1: length 13.2
  Top Layer w0.152: 9.15,8.85 9.15,9.5 8.94,9.71 8.94,9.86 8.99,9.92 9.21,9.92 10.56,8.57 13.6,8.57 14.83,7.33 16.16,7.33 16.68,6.81 16.68,5.08 16.57,4.97 16.34,4.97 16.24,5.07 U2.8
DP2: length 9.4
  Top Layer w0.152: 14.96,5.72 14.96,6.65 13.54,8.07 8.06,8.07 7.55,8.58 7.55,8.85
DP3: length 9.8
  Top Layer w0.152: 13.68,5.72 13.68,6.72 12.94,7.46 7.75,7.46 7.39,7.82 7.08,7.82 6.79,8.11 6.38,8.11 5.95,8.53 CN4.5
DP4: length 13
  Top Layer w0.152: USB2.8 6.25,6.9 6,7.15 5.51,7.15 5.25,6.9 USB2.6 5.25,5.52 5.32,5.45 5.32,4.62 6.09,3.85 11.67,3.85 12.25,4.43 12.25,4.86 12.4,5 U2.2
DP_IN: length 43
  Top Layer w0.152: U2.11 14.96,10.39 15.1,10.25 15.1,8.7 15.72,8.07 17,8.07 17.3,7.77 17.3,4.93 17.63,4.6 19.03,4.6 19.56,4.06 20.6,4.06 21,3.66 21,2.34 21.87,1.47 36.68,1.47 37.39,2.19 37.39,2.77 38.4,3.78 41.96,3.78 42.82,4.65 42.82,5.97 42.96,6.1 USB1.6 44.73,6.1 44.93,6.3 44.93,6.86 44.69,7.1 USB1.8
LOWPOWER_LED: length 8.3
  Top Layer w0.203: LED2.3 23.62,2.56 R40.1
  Top Layer w0.254: U11.5 19.38,6.35 19.63,6.1 19.63,5.13 19.91,4.85 20.88,4.85 21.69,4.04 21.69,2.82 21.95,2.56 R40.1
VOUT: length 11.3
  Top Layer w0.203: LED1.2 29.07,3.73 24.68,3.73 23.74,4.67 Q2.3
  Top Layer w0.254: R40.2 22.3,5.71 22.1,5.92
  vias: v2(25.3,12.22) v2(25.98,12.22) v2(26.67,12.22) v3(4.37,12.17) v3(4.37,11.25)
$1N510: length 12.6
  Top Layer w0.203: R2.2 40.37,12 39.88,11.51 39.88,9.19 40.41,8.66 41.88,8.66 42.45,8.1 USB1.10
$1N514: length 5.7
  Top Layer w0.203: R1.2 v1(45.8,4.04) ; USB1.4 v1(44.45,5.1)
  Bottom Layer w0.203: v1(45.8,4.04) 44.73,5.1 v1(44.45,5.1)
$1N3050: length 1.6
  Top Layer w0.203: LED1.1 34.35,2.81 R10.1
$1N38183: length 4
  Top Layer w0.152: R33.2 19.3,3.61 19.08,3.84 17.02,3.84 16.79,3.61 SW1.3
$1N38879: length 1.6
  Top Layer w0.254: U4.5 27.78,8.45 27.38,8.05 R3.2
$1N38917: length 15.7
  Top Layer w0.152: v1(20.34,3.43) 19.91,3.01 19.91,1.88 19.69,1.65 17.77,1.65 16.93,2.49 15.22,2.49 14.99,2.72 SW1.2
  Top Layer w0.203: v1(25.65,6.1) 25.65,5.79 Q2.1
  Bottom Layer w0.152: v1(20.34,3.43) 20.62,3.71 23.83,3.71 25.65,5.53 v1(25.65,6.1)
$1N38949: length 19
  Top Layer w0.152: R41.2 12.22,1.98 13.18,1.02 16.82,1.02 17.14,1.34 19.89,1.34 20.35,1.8 v1(20.35,2.82)
  Bottom Layer w0.152: v1(20.35,2.82) 20.93,3.4 23.95,3.4 26.09,5.54 v1(26.09,6.58)
$1N38952: length 3.6
  Top Layer w0.152: R41.1 11.05,3.38 11.21,3.54 13.91,3.54 SW1.1
$1N41051: length 7
  Top Layer w0.152: R44.2 1.87,8.68 2.65,7.9 4.05,7.9 4.45,7.5 6.45,7.5 6.8,7.15 7.15,7.15 7.25,7.05 USB2.10
$1N41052: length 3.7
  Top Layer w0.152: 4.25,6.38 4.25,7.08 3.76,7.57 2.36,7.57 2.14,7.79 R43.2
$1N42853: length 4.1
  Top Layer w0.203: R42.2 27.99,2.41 27.74,2.16 25.06,2.16 24.9,2.33 LED2.1
$1N44886: length 3.8
  Top Layer w0.203: 21.37,11.75 23.84,11.75 24.12,11.46 D2.3

## Copper pours and planes (outline as drawn; the poured copper is in the pictures)
3.3V on Top Layer: 18.62,8.04 17.79,8.04 17.73,8.1 17.73,8.74 16.59,9.88 16.59,12.09 16.48,12.19 14.73,12.19 14.63,12.09 14.63,10.64 14.53,10.54 13.46,10.54 13.39,10.62 13.39,12.36 13.81,12.79 17.46,12.79 17.87,12.37 17.87,11.06 17.81,11 17.3,11 17.2,10.9 17.2,10.04 17.29,9.95 18.02,9.95 18.34,10.26 19.23,10.26 19.33,10.16 19.33,9.56 19.22,9.45 18.84,9.45 18.67,9.28 18.67,8.09
GND on Top Layer: 21.29,5.99 20.12,5.99 19.99,6.12 19.99,6.66 20.12,6.78 21.34,6.78 21.51,6.96 21.51,7.75 21.64,7.87 22.78,7.87 22.91,7.75 22.91,6.55 22.81,6.45 21.74,6.45
GND on Top Layer: 43.05,11.25 43.05,9.3 43.11,9.24 44.21,9.24 44.24,9.27 44.24,9.86 44.34,9.96 45.03,9.96 45.31,10.24 45.31,11.25 45.08,11.48 43.28,11.48
GND on Top Layer: 0.58,7.01 2.54,7.01 2.6,6.95 2.6,5.85 2.57,5.82 1.98,5.82 1.88,5.72 1.88,5.03 1.6,4.75 0.58,4.75 0.36,4.98 0.36,6.78
GND on Top Layer: 17.3,10.77 17.37,10.85 18.05,10.85 18.19,10.98 18.19,11.18 18.34,11.33 19.29,11.33 19.46,11.49 19.46,11.96 19.61,12.12 20.35,12.12 20.52,11.94 20.52,11.3 20.68,11.15 21.95,11.15 22.28,11.48 23.22,11.48 23.37,11.33 23.37,10.53 23.23,10.39 20.73,10.39 20.5,10.16 20.5,9.5 20.98,9.02 20.98,8.08 20.8,7.9 19.23,7.9 19.05,8.08 19.05,9.04 19.51,9.5 19.51,10.19 19.3,10.39 18.24,10.39 17.96,10.11 17.37,10.11 17.3,10.19
GND on Top Layer: 10.39,7 8.44,7 8.38,6.94 8.38,5.84 8.41,5.8 9,5.8 9.1,5.7 9.1,5.02 9.38,4.74 10.39,4.74 10.62,4.97 10.62,6.77
GND on Top Layer: 43.03,1.45 43.03,3.4 43.09,3.46 44.19,3.46 44.23,3.43 44.23,2.84 44.33,2.74 45.02,2.74 45.29,2.46 45.29,1.45 45.07,1.22 43.26,1.22
GND on Top Layer: 36.09,4.85 35.26,4.85 35.15,4.95 35.15,7.04 35.33,7.21 36.5,7.21 36.65,7.06 36.65,5.41
GND on Top Layer: 1.32,11.66 2.84,11.66 3.07,11.43 3.07,9.93 3.38,9.63 3.68,9.63 3.86,9.45 3.86,8.31 3.68,8.13 3.07,8.13 2.11,9.09 1.42,9.09 1.09,9.42 1.09,11.43
GND on Top Layer: 37.72,2.69 38.63,3.61 41.81,3.61 41.99,3.43 41.99,2.04 42.16,1.87 42.84,1.87 43.03,2.06 43.03,2.34 43.31,2.62 45.04,2.62 45.29,2.36 45.29,0.79 45.03,0.53 38.02,0.53 37.72,0.84
GND on Top Layer: 29.49,12.4 30.43,12.4 30.58,12.24 30.58,11.35 30.43,11.2 30.03,11.2 29.78,10.95 29.78,9.95 29.97,9.75 32.51,9.75 32.64,9.63 32.64,8.64 32.54,8.53 31.65,8.53 31.22,8.97 29.16,8.97 28.86,9.26 28.86,10.85 29.49,11.48
GND on Top Layer: 9.93,11.89 11,11.89 11.18,11.71 11.18,10.14 10.97,9.93 9.93,9.93 9.73,10.14 9.73,11.68
GND on Bottom Layer: 0.19,12.85 2.98,12.85 3.25,12.58 3.25,10.59 3.51,10.34 4.39,10.34 4.67,10.62 4.67,11.25 4.83,11.41 27.21,11.41 27.46,11.65 27.46,12.67 27.8,13.02 49.56,13.02 50.01,12.57 50.01,0.53 49.53,0.05 0.23,0.05 0,0.28 0,12.67
VBUS on Top Layer: 43.08,4.27 44.22,4.27 45.19,5.23 45.19,7.42 44.17,8.43 42.47,8.43 41.88,9.02 40.64,9.02 40.26,9.4 40.26,10.97 40.36,11.07 42.19,11.07 42.32,10.95 42.32,9.78 43.05,9.05 44.92,9.05 46.13,7.85 46.13,5.03 44.73,3.63 43.08,3.63 43.03,3.68 43.03,4.22
VBUS on Top Layer: 2.83,6.92 3.39,6.92 3.43,6.88 3.43,5.82 3.58,5.66 4.14,5.66 4.29,5.51 4.29,3.96 4.04,3.71 3.33,3.71 3.07,3.96 3.07,5.06 2.79,5.34 2.79,6.89
VBUS on Top Layer: 8.19,6.93 8.22,6.9 8.22,5.62 7.94,5.34 7.94,4.68 7.76,4.5 6.87,4.5 6.72,4.65 6.72,5.52 6.87,5.67 7.43,5.67 7.58,5.82 7.58,6.89 7.62,6.93
VBUS on Top Layer: 44.17,4.25 44.3,4.13 44.3,3.76 44.19,3.65 43.17,3.65 42.9,3.38 42.9,2.13 42.8,2.03 42.17,2.03 42.08,2.12 42.08,3.64 42.69,4.25
VBUS on Bottom Layer: 7.77,4.52 6.76,4.52 6.58,4.7 6.58,5.42 6.35,5.65 4.58,5.65 4.33,5.39 4.33,3.93 4.57,3.68 10.44,3.68 11.12,4.37 18.62,4.37 19.18,3.81 19.18,1.56 19.48,1.26 41.53,1.26 41.81,1.54 41.81,3.58 41.96,3.72 42.8,3.72 42.95,3.58 42.95,0.5 42.7,0.25 18.29,0.25 18.11,0.43 18.11,2.97 17.88,3.2 11.74,3.2 11.15,2.6 3.7,2.6 3.25,3.05 3.25,6.13 3.72,6.6 7.52,6.6 8,6.12 8,4.75
VBUS_5V on Top Layer: 37.94,7.99 42.14,7.99 42.14,4.85 41.78,4.5 38.34,4.5 37.15,3.3 29.85,3.3 29.2,3.95 25.18,3.95 24.51,4.62 24.51,7.95 25.85,9.29 25.85,10.05 25.99,10.19 26.72,10.19 27.36,10.82 27.71,10.82 27.79,10.9 27.79,12.29 27.99,12.5 28.85,12.5 29.04,12.31 29.04,11.44 28.68,11.07 28.68,10.01 28.52,9.86 27.61,9.86 27.18,9.42 27.18,8.59 26.67,8.08 25.65,8.08 25.34,7.77 25.34,5 25.65,4.7 29.72,4.7 30.38,4.04 36.85,4.04 37.7,4.89 37.7,7.75
VB_IN on Top Layer: 32.55,10.03 30.02,10.03 30.02,10.74 30.2,10.92 30.96,10.92 31.75,11.71 34.77,11.71 35.03,11.46 35.03,4.9 34.21,4.9 34.21,6.33 34.09,6.45 29.97,6.45 29.87,6.55 29.87,7.44 29.97,7.54 34,7.54 34.21,7.76 34.21,10.62 34.04,10.8 32.87,10.8 32.69,10.62 32.69,10.18
VOUT on Top Layer: 4.01,10.08 3.63,10.47 3.63,12.5 3.84,12.7 4.9,12.7 5.08,12.52 5.08,10.47 4.7,10.08 4.71,8.39 4.58,8.27 4.13,8.27 4.01,8.39
VOUT on Top Layer: 24.33,5.46 24,5.13 20.21,5.13 20.17,5.17 20.17,5.7 20.22,5.74 21.34,5.74 21.9,6.3 23.06,6.3 23.22,6.45 23.22,8.15 24.94,9.88 24.94,12.55 25.17,12.77 26.98,12.77 27.13,12.62 27.13,11.07 27,10.95 26.07,10.95 25.68,10.55 25.68,9.37 24.33,8.03
VOUT on Bottom Layer: 26.87,12.8 27.18,12.5 27.18,11.86 26.91,11.59 5.29,11.59 5.13,11.43 5.13,10.82 4.93,10.62 3.73,10.62 3.53,10.82 3.53,12.6 3.73,12.8
$1N38949 on Top Layer: 39.22,11.66 39.62,11.25 39.62,9.88 39.5,9.75 38.16,9.75 38.03,9.88 38.03,10.58 37.82,10.8 36.4,10.8 36.19,10.59 36.19,8.12 36.36,7.95 37.31,7.95 37.52,7.74 37.52,5 36.69,4.17 31.06,4.17 30.96,4.27 30.96,5.03 30.45,5.54 28.04,5.54 27.51,6.07 26.09,6.07 25.56,6.6 25.56,7.7 26.54,7.7 26.54,6.83 26.67,6.7 29.01,6.7 29.41,6.3 31.62,6.3 32.11,5.81 32.11,4.95 32.29,4.77 36.26,4.77 36.75,5.26 36.75,7.14 36.55,7.34 35.66,7.34 35.28,7.72 35.28,11.38 35.56,11.66
$1N44886 on Top Layer: 24.74,11.05 24.74,10.06 23.83,9.14 22.45,9.14 22.22,8.92 22.22,8.28 22.07,8.13 21.23,8.13 21.08,8.27 21.08,9.22 20.8,9.5 20.8,10.11 20.88,10.19 23.37,10.19 23.61,10.43 23.61,11.04 23.75,11.18 24.61,11.18

## Text on the board
Bottom Solder Mask Layer: Designed By | 某科学的超电磁铁
Top Silkscreen Layer: OFF/ON | +
